# EAGLE design Grove - Sliding Potentiometer (EAGLE 7.2.0)
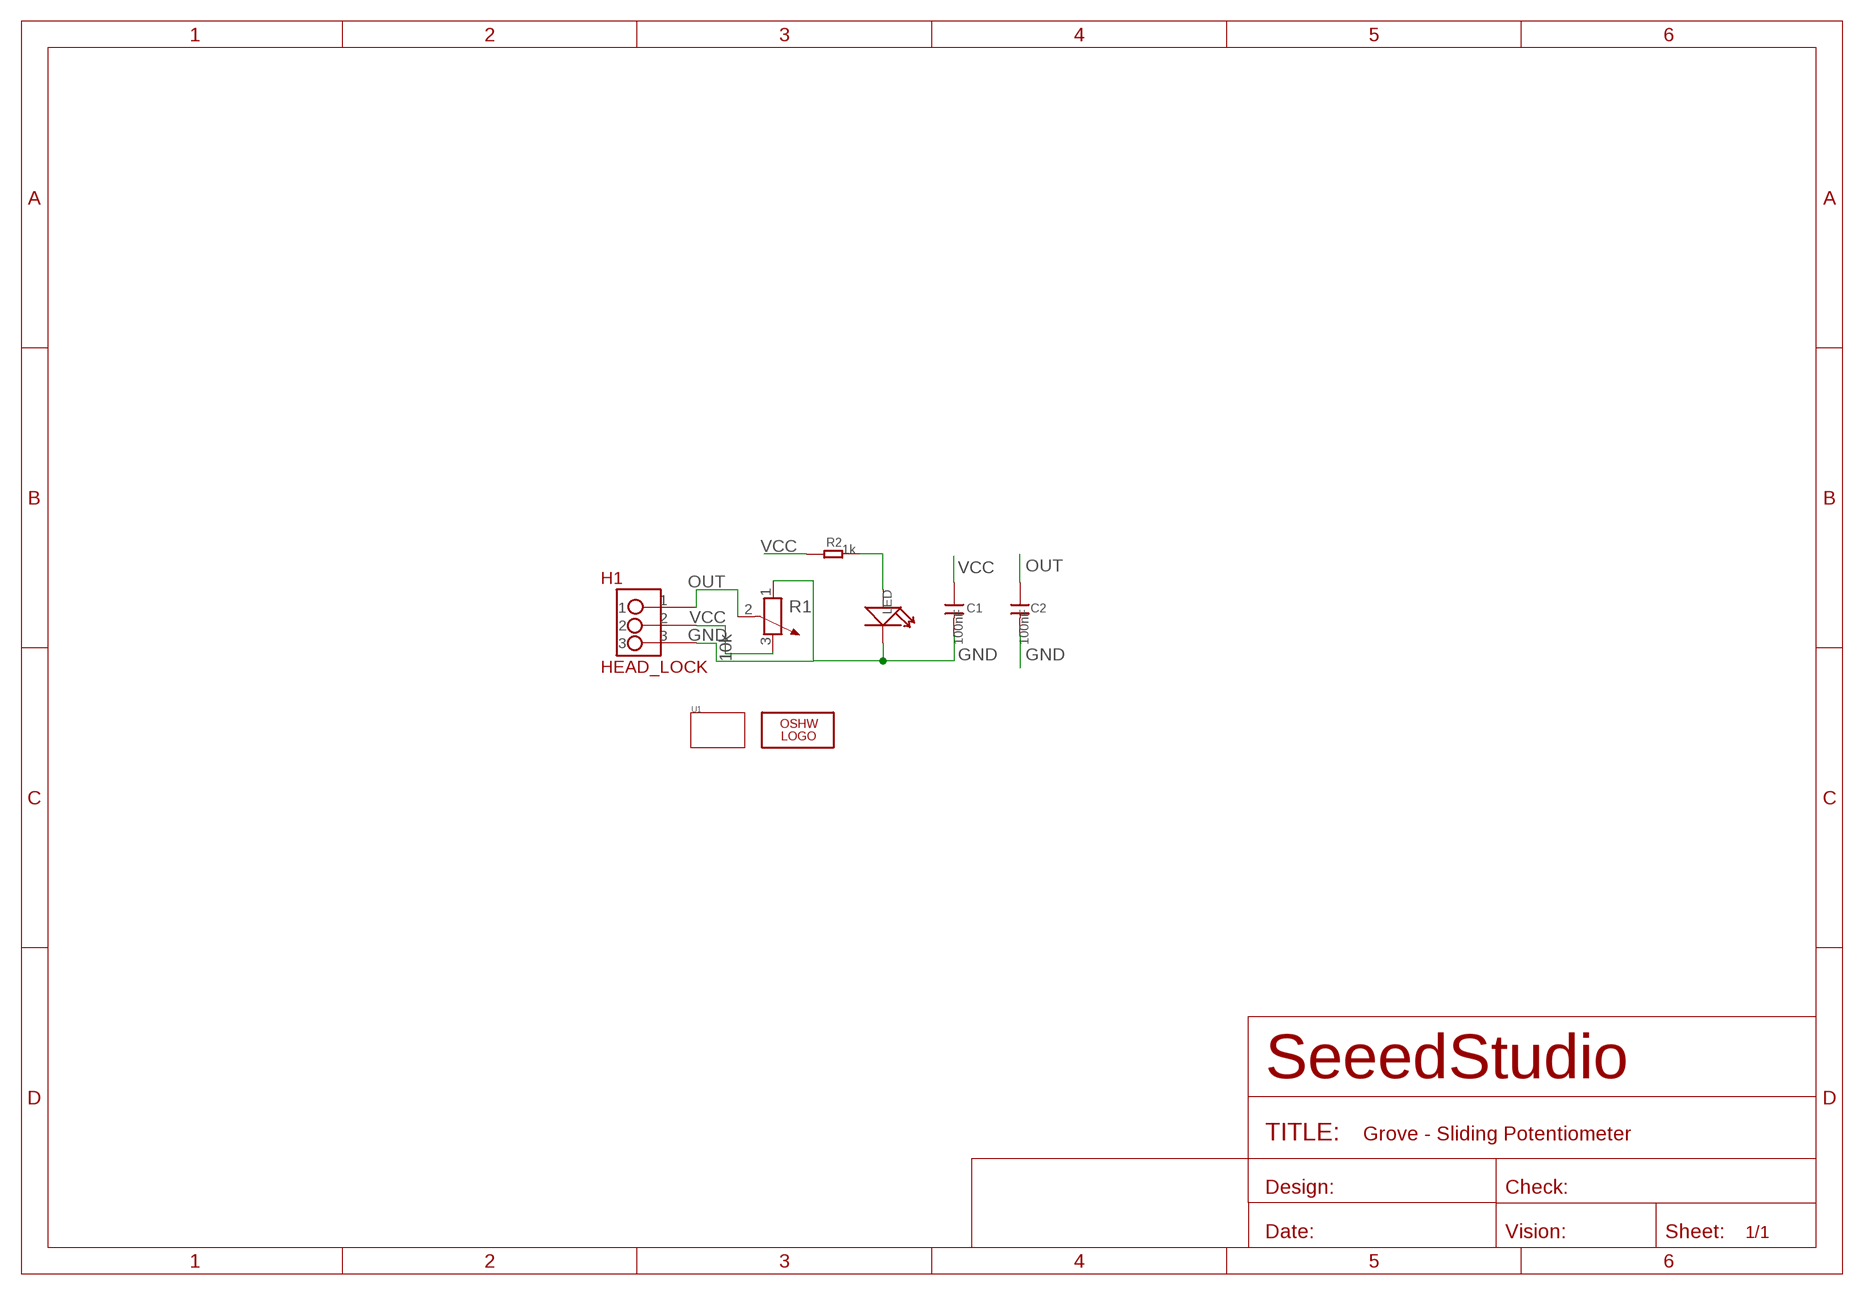
[diagram p0: schematic, sheet 1]

## Parts
C1  100nF  C-0805  [0805]
C2  100nF  C-0805  [0805]
H1  HEAD_LOCK  [HEAD_LOCK]
LED  LED'0805'  [LED-0805]
LOGO1  LOGO-OSHW-FILLX0200-NT  [OSHW_FILLX200_NOTEXT]
R1  10k  R-POTENTIOMETER  [3P-SQUA-45.6X10X5.8H]
R2  1k  R-0805  [0805]
U1  TWIG'3U'  [3U-DIM-W/-DRILL]

## Nets
GND: C1.2 C2.2 H1.3 LED.- R1.1
N$3: R2.1
N$5: LED.+ R2.2
OUT: C2.1 H1.1 R1.2
VCC: C1.1 H1.2 R1.3

## Library data of the parts
C1 C2 = Discrete:C*: Ceramic Capacitors
H1 = HEAD_LOCK:HEAD_LOCK: 带锁的排座
LED = Discrete:LED*
LOGO1 = Logo:LOGO-OSHW-FILL
R1 = Discrete:R-POTENTIOMETER*: Potentiometer
R2 = Discrete:R*
U1 = Module:TWIG

## Board
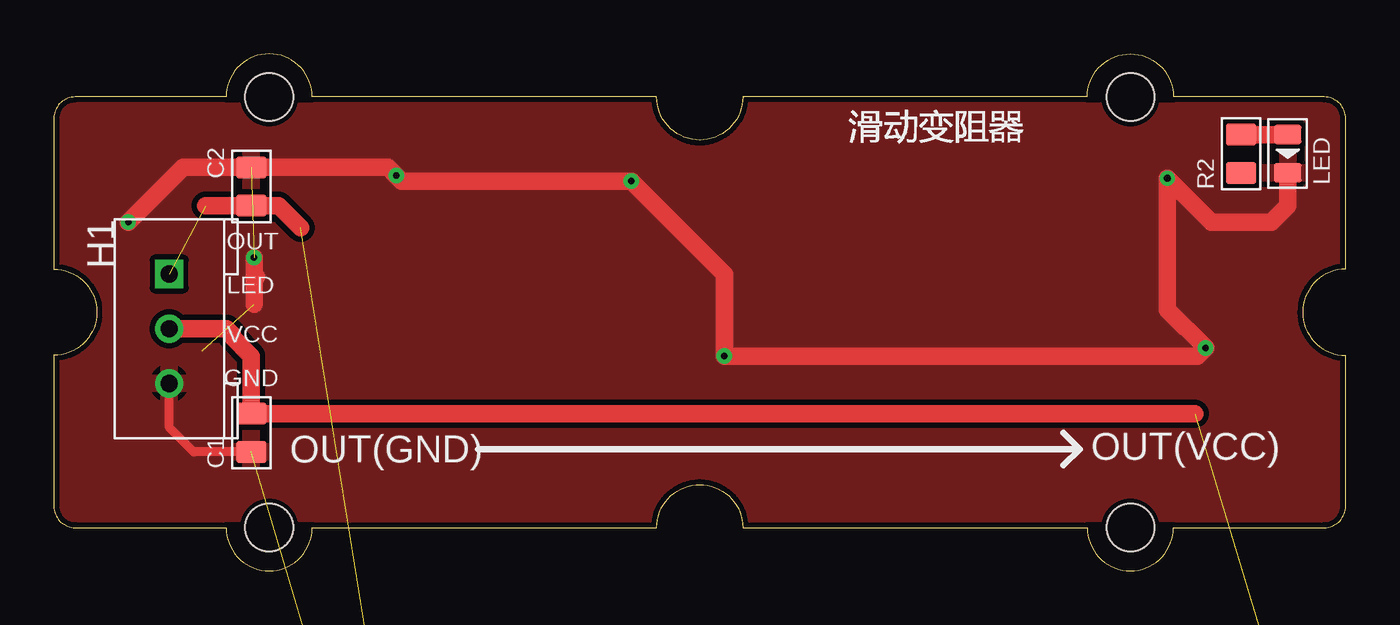
[diagram p1: board, top side]
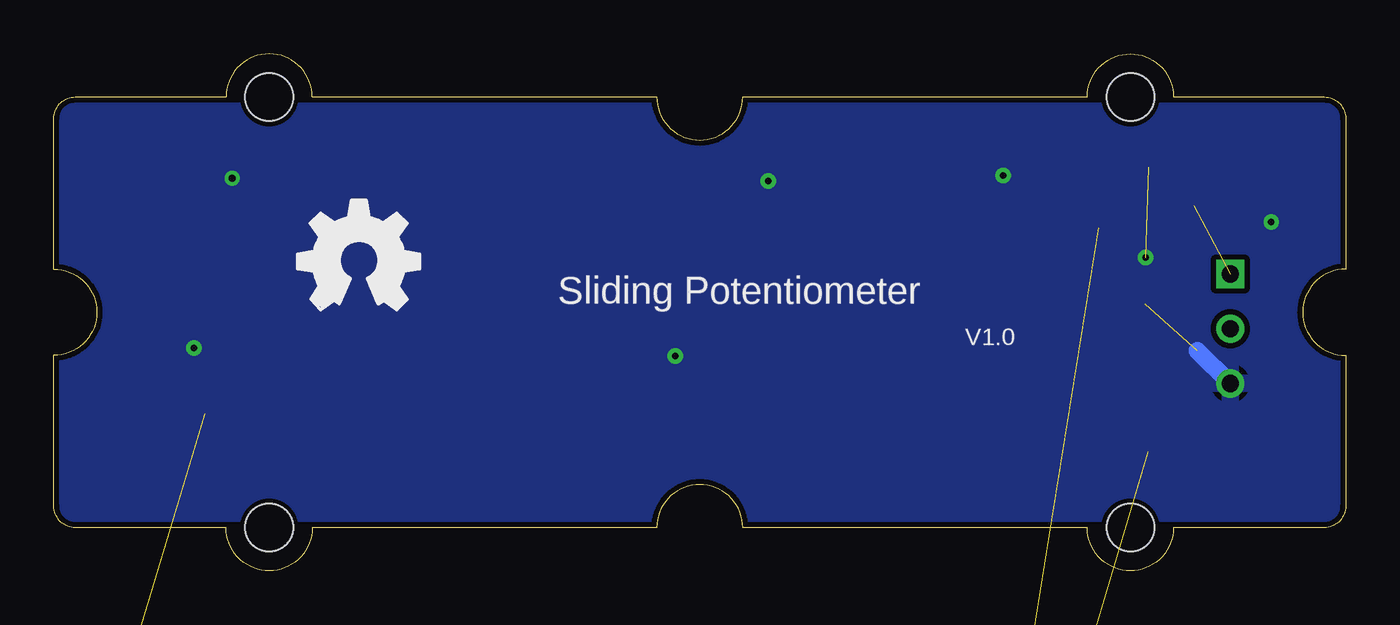
[diagram p2: board, bottom side, seen from below]

Size 60 x 24 mm. Coordinates in mm from the lower left corner, seen from the top.
Copper layers (1*16): Top 0.035mm / dielectric 1.5mm / Bottom 0.035mm
Design rules "default": minimum track width 6mil, minimum drill 12mil, track to track 6mil, track to pad 6mil, pad to pad 6mil, via to via 6mil, smd to smd 6mil, copper to edge 10mil, drill to drill 10mil, minimum pad ring 10mil, minimum via ring 8mil, stop-mask expansion 2mil, vias tented up to drill 100mil, thermal gap 10mil

### Footprints (pad centres in the part's own frame; a part is rotated, then mirrored left to right if it is on the bottom)
0805 = smd 1.016 x 1.397: 1 -0.889,0; 2 0.889,0
HEAD_LOCK = drill 0.8 square: 1 0,0 | drill 0.8: 2 2.54,0; 3 5.08,0
LED-0805 = smd 0.889 x 1.27: + -0.889,0; - 0.889,0
3P-SQUA-45.6X10X5.8H = drill 1.143 pad 1.905 square: 1 -22.225,-1.905 | drill 1.143 pad 1.905: 2 -22.225,1.905; 3 22.225,-1.905
3U-DIM-W/-DRILL = hole 2.2: -20,10; -20,-10; 20,10; 20,-10

### Placement (x,y rotation side)
C1  9.17,6.41 270 top
C2  9.17,17.84 90 top
H1  5.36,13.78 270 top
LED  57.3,19.37 270 top
LOGO1  48.67,12.13 0 bottom
R1  38.71,-17.18 0 top  (outside the outline)
R2  55.15,19.37 90 top
U1  30,12 0 top

### Tracks (layer width: path | path; a pad name or v marks a point on that pad's centre or on a via)
GND  (via drill 0.3 pad 0.64)  (3 unrouted)
  Top 0.406: C1.2 6.5,5.52 5.36,6.67 H1.3
  Top 0.813: v3.46,16.19 6,18.73 C2.2 15.52,18.73 v15.9,18.35 16.16,18.1 v26.83,18.1 31.14,13.78 v31.14,9.97 53.11,9.97 v53.5,10.35 51.72,12.13 v51.72,18.22 53.75,16.19 56.54,16.19 57.3,16.95 LED.- | 9.43,13.65 9.3,13.78 v9.3,14.54 9.3,12.38
  Bottom 0.813: 6.89,10.22 H1.3
  pour Bottom (isolate 0.254): -3.15,25.08 -3.15,-2.86 62.89,-2.86 62.89,-1.59 62.89,26.35 -3.15,26.35
  pour Top (isolate 0.254): -0.61,-1.59 61.62,-1.59 61.62,25.08 -1.88,25.08 -1.88,-1.59
N$5
  Top 0.813: R2.2 LED.+
OUT  (2 unrouted)
  Top 0.813: 11.46,15.94 10.44,16.95 C2.1 7.06,16.95
VCC  (1 unrouted)
  Top 0.813: 52.99,7.3 C1.1 9.17,9.97 8.28,10.86 8.28,10.98 8.03,11.24 H1.2
(copper drawn outside any net)
  shapes: Top area x1

### Text on the board
tPlace: OUT(VCC) | OUT(GND)
bPlace: Sliding Potentiometer | V1.0
tNames: OUT | LED | VCC | GND